# Altium schematic sheet CCP_I2C.SchDoc
size A
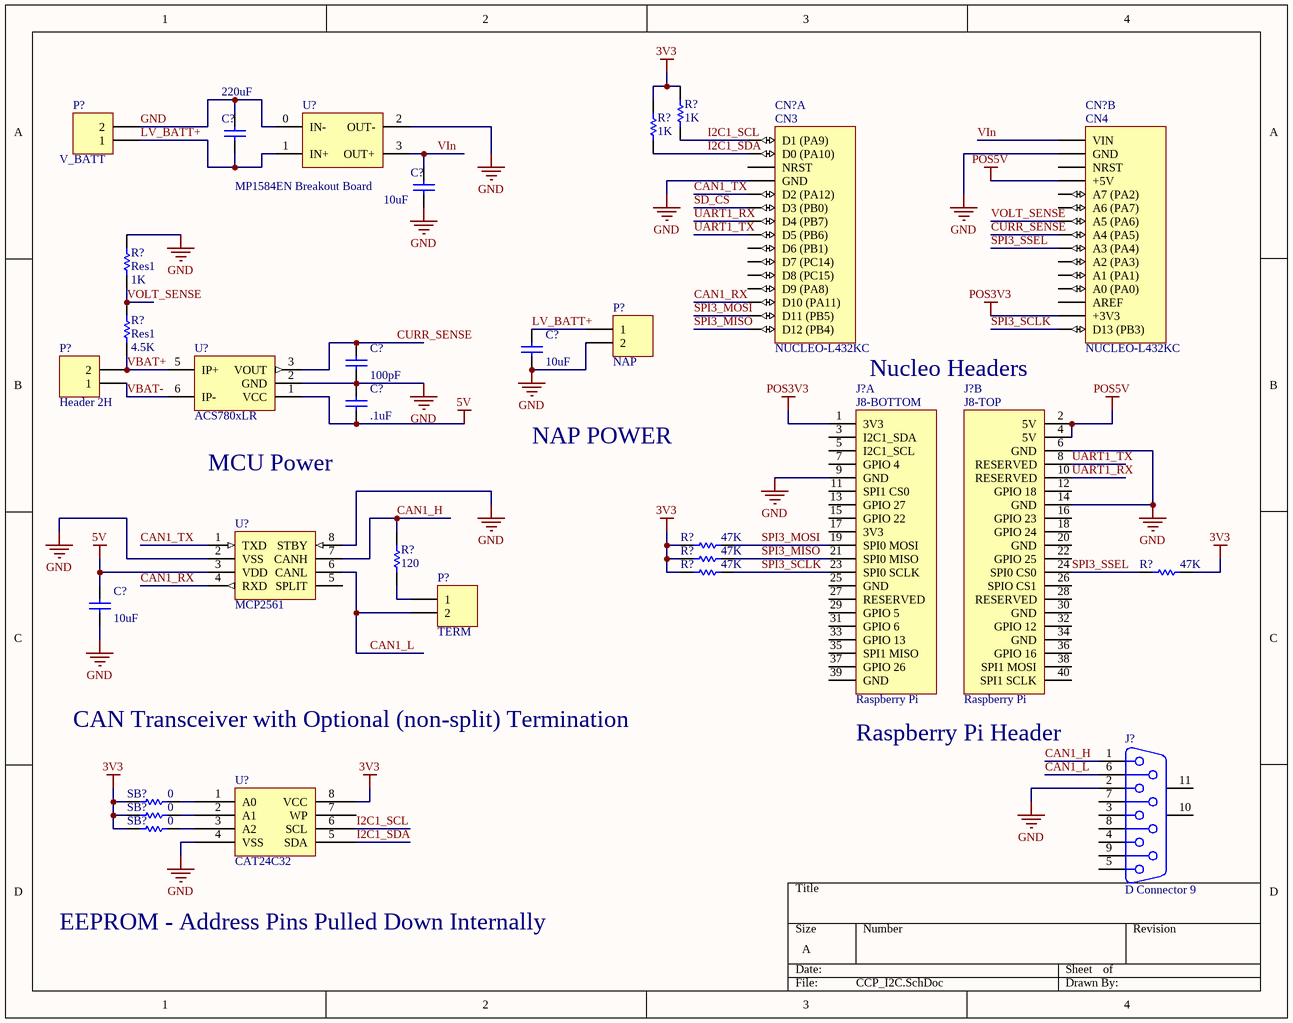
[diagram p0: CCP_I2C.SchDoc]

## Parts
(Parts that share a designator on the sheet are numbered #1, #2 ... from top to bottom, then left to right.)
C?#1  value 220uF  [CAPR5-4X5]  (hidden comment: Cap)
C?#2  value 10uF  [C1206]  (hidden comment: Cap)
C?#3  value 10uF  [C1206]  (hidden comment: Cap)
C?#4  value 100pF  [1608[0603]]  (hidden comment: Cap Semi)
C?#5  value .1uF  [1608[0603]]  (hidden comment: Cap Semi)
C?#6  value 10uF  [C1206]  (hidden comment: Cap)
CN?#1  NUCLEO-L432KC  [NUCLEO-32]  (part A of 2)
CN?#2  NUCLEO-L432KC  [NUCLEO-32]  (part B of 2)
J?#1  Raspberry Pi  [RASPBERRY PI]  (part A of 2)
J?#2  Raspberry Pi  [RASPBERRY PI]  (part B of 2)
J?#3  D Connector 9  [DSUB1.385-2H9]
P?#1  V_BATT  [2POS TERM BLOCK]
P?#2  NAP  [HDR1X2]
P?#3  Header 2H  [2POS TERM BLOCK]
P?#4  TERM  [HDR1X2]
R?#1  value 1K  [6-0805_M]  (hidden comment: Res1)
R?#2  value 1K  [6-0805_M]  (hidden comment: Res1)
R?#3  Res1  value 1K  [AXIAL-0.3]
R?#4  Res1  value 4.5K  [AXIAL-0.3]
R?#5  value 47K  [6-0805_M]  (hidden comment: Res1)
R?#6  value 47K  [6-0805_M]  (hidden comment: Res1)
R?#7  value 47K  [6-0805_M]  (hidden comment: Res1)
R?#8  value 47K  [6-0805_M]  (hidden comment: Res1)
R?#9  value 120  [6-0805_M]  (hidden comment: Res1)
SB?#1  value 0  [6-0805_M]  (hidden comment: Res1)
SB?#2  value 0  [6-0805_M]  (hidden comment: Res1)
SB?#3  value 0  [6-0805_M]  (hidden comment: Res1)
U?#1  MP1584EN Breakout Board  [MP1584EN Breakout]
U?#2  ACS780xLR  [7-pin PSOF]
U?#3  MCP2561  [SO8_L]
U?#4  CAT24C32  [SO8_N]

## Nets
3V3: R?#1.2 R?#2.2 R?#5.1 R?#6.1 R?#7.1 R?#8.2 SB?#1.2 SB?#2.2 SB?#3.2 U?#4.8(VCC)
5V: C?#5.1 C?#6.2 U?#2.1(VCC) U?#3.3(VDD)
GND: C?#1.2 C?#2.1 C?#3.1 C?#4.1 C?#5.2 C?#6.1 CN?#1.4(GND) CN?#2.29(GND) J?#1.9(GND) J?#2.6(GND) J?#2.14(GND) J?#3.2 P?#1.2 P?#2.2 R?#3.2 U?#1.0(IN-) U?#1.2(OUT-) U?#2.2(GND) U?#3.2(VSS) U?#3.8(STBY) U?#4.4(VSS)
POS3V3: CN?#2.17(+3V3) J?#1.1(3V3)
POS5V: CN?#2.27(+5V) J?#2.2(5V) J?#2.4(5V)
CAN1_H: J?#3.1 R?#9.2 U?#3.7(CANH)
CAN1_L: J?#3.6 P?#4.2 U?#3.6(CANL)
CAN1_RX: CN?#1.13(D10_(PA11)) U?#3.4(RXD)
CAN1_TX: CN?#1.5(D2_(PA12)) U?#3.1(TXD)
CURR_SENSE: C?#4.2 CN?#2.23(A4_(PA5)) U?#2.3(VOUT)
I2C1_SCL: CN?#1.1(D1_(PA9)) R?#1.1 U?#4.6(SCL)
I2C1_SDA: CN?#1.2(D0_(PA10)) R?#2.1 U?#4.5(SDA)
LV_BATT+: C?#1.1 C?#3.2 P?#1.1 P?#2.1 U?#1.1(IN+)
SD_CS: CN?#1.6(D3_(PB0))
SPI3_MISO: CN?#1.15(D12_(PB4)) J?#1.21(SPI0_MISO) R?#6.2
SPI3_MOSI: CN?#1.14(D11_(PB5)) J?#1.19(SPI0_MOSI) R?#5.2
SPI3_SCLK: CN?#2.16(D13_(PB3)) J?#1.23(SPI0_SCLK) R?#7.2
SPI3_SSEL: CN?#2.22(A3_(PA4)) J?#2.24(SPI0_CS0) R?#8.1
UART1_RX: CN?#1.7(D4_(PB7)) J?#2.10(RESERVED)
UART1_TX: CN?#1.8(D5_(PB6)) J?#2.8(RESERVED)
VBAT+: P?#3.2 R?#4.1 U?#2.5(IP+)
VBAT-: P?#3.1 U?#2.6(IP-)
VIn: C?#2.2 CN?#2.30(VIN) U?#1.3(OUT+)
VOLT_SENSE: CN?#2.24(A5_(PA6)) R?#3.1 R?#4.2
NetP?#4_1: P?#4.1 R?#9.1
NetSB?#1_1: SB?#1.1 U?#4.1(A0)
NetSB?#2_1: SB?#2.1 U?#4.2(A1)
NetSB?#3_1: SB?#3.1 U?#4.3(A2)

Not connected (* = marked no-connect by the designer): CN?#1 3(NRST) 9(D6_(PB1)) 10(D7_(PC14)) 11(D8_(PC15)) 12(D9_(PA8)); CN?#2 18(AREF) 19(A0_(PA0)) 20(A1_(PA1)) 21(A2_(PA3)) 25(A6_(PA7)) 26(A7_(PA2)) 28(NRST); J?#1 3(I2C1_SDA) 5(I2C1_SCL) 7(GPIO_4) 11(SPI1_CS0) 13(GPIO_27) 15(GPIO_22) 17(3V3) 25(GND) 27(RESERVED) 29(GPIO_5) 31(GPIO_6) 33(GPIO_13) 35(SPI1_MISO) 37(GPIO_26) 39(GND); J?#2 12(GPIO_18) 16(GPIO_23) 18(GPIO_24) 20(GND) 22(GPIO_25) 26(SPIO_CS1) 28(RESERVED) 30(GND) 32(GPIO_12) 34(GND) 36(GPIO_16) 38(SPI1_MOSI) 40(SPI1_SCLK); J?#3 3 4 5 7 8 9 10(MH1) 11(MH2); U?#3 5(SPLIT); U?#4 7(WP)

## Notes on the sheet
- (near J?#2) Nucleo Headers
- MCU Power
- NAP POWER
- CAN Transceiver with Optional (non-split) Termination
- (near J?#1) Raspberry Pi Header
- EEPROM - Address Pins Pulled Down Internally
- (in symbol NUCLEO-L432KC, part A) CN3
- (in symbol NUCLEO-L432KC, part B) CN4
- (in symbol Raspberry Pi, part A) J8-BOTTOM
- (in symbol Raspberry Pi, part B) J8-TOP

## Library data of the parts
C?#1-C?#3 C?#6 = Cap: Capacitor; Published: 8-Jun-2000; LatestRevisionDate: 17-Jul-2002; LatestRevisionNote: Re-released for DXP Platform.; PackageReference: RAD-0.3; Publisher: Altium Limited; PackageDescription: Radial Cap, Thru-Hole; 2 Leads; 0.3 in Pin Spacing
C?#4 C?#5 = Cap Semi: Capacitor (Semiconductor SIM Model); Published: 8-Jun-2000; LatestRevisionDate: 29-May-2009; LatestRevisionNote: IPC-7351 Footprint Added.; PackageReference: C1206; Publisher: Altium Limited; PackageDescription: Chip Capacitor
CN?#1 CN?#2 = NUCLEO-L432KC: STM32L432KC Development Board; ComponentLink1Description: MBED; ComponentLink1URL: https://os.mbed.com/platforms/ST-Nucleo-L432KC/; ComponentLink2Description: Digikey; ComponentLink2URL: https://www.digikey.com/products/en?keywords=NUCLEO-L432KC
J?#1 J?#2 = Raspberry Pi: 2x20 Header
J?#3 = D Connector 9: Receptacle Assembly, 9 Position, Right Angle; PackageDocument: O; Positions: 9; Published: 15-Jun-2001; LatestRevisionDate: 17-Jul-2002; LatestRevisionNote: Re-released for DXP Platform.; DatasheetDocument: 1-Sep-1999; PackageReference: 788750; Publisher: Altium Limited; Orientation: Right Angle; Gender: Receptacle
P?#1 P?#2 P?#4 = Header 2: Header, 2-Pin; LatestRevisionDate: 17-Jul-2002; LatestRevisionNote: Re-released for DXP Platform.; Publisher: Altium Limited
P?#3 = Header 2H: Header, 2-Pin, Right Angle; LatestRevisionDate: 17-Jul-2002; LatestRevisionNote: Re-released for DXP Platform.; Publisher: Altium Limited
R?#1-R?#9 SB?#1-SB?#3 = Res1: Resistor; Published: 8-Jun-2000; LatestRevisionDate: 17-Jul-2002; LatestRevisionNote: Re-released for DXP Platform.; PackageReference: AXIAL-0.3; Publisher: Altium Limited; PackageDescription: Axial Device, Thru-Hole; 2 Leads; 0.3 in Pin Spacing
U?#1 = MP1584EN Breakout Board: Buck Converter; ComponentLink1Description: Part; ComponentLink1URL: https://www.amazon.com/eBoot-MP1584EN-Converter-Adjustable-Module/dp/B01MQGMOKI/
U?#2 = ACS780xLR: Hall-Effect Current Sensor; ComponentLink1Description: Part; ComponentLink1URL: https://www.digikey.com/product-detail/en/allegro-microsystems-llc/ACS780LLRTR-050B-T/620-1817-1-ND/6189106
U?#3 = MCP2561: CAN Transciever; ComponentLink1Description: Part; ComponentLink1URL: https://www.digikey.com/product-detail/en/microchip-technology/MCP2561-E-SN/MCP2561-E-SN-ND/4079961; ComponentLink2Description: Datasheet; ComponentLink2URL: http://ww1.microchip.com/downloads/en/DeviceDoc/20005167C.pdf
U?#4 = CAT24C32: I2C EEPROM; ComponentLink1Description: Part; ComponentLink1URL: https://www.digikey.com/product-detail/en/on-semiconductor/CAT24C32WI-GT3/CAT24C32WI-GT3CT-ND/1631159; ComponentLink2Description: Datasheet; ComponentLink2URL: http://www.onsemi.com/pub/Collateral/CAT24C32-D.PDF